# Altium schematic sheet Mobo.SchDoc: Tray 2 Motherboard
size A2; DrawnBy: M. Wenke; Engineer: M. Wenke; DocumentNumber: CRSC0007; SheetNumber: 1; SheetTotal: 1; Version: 1.0
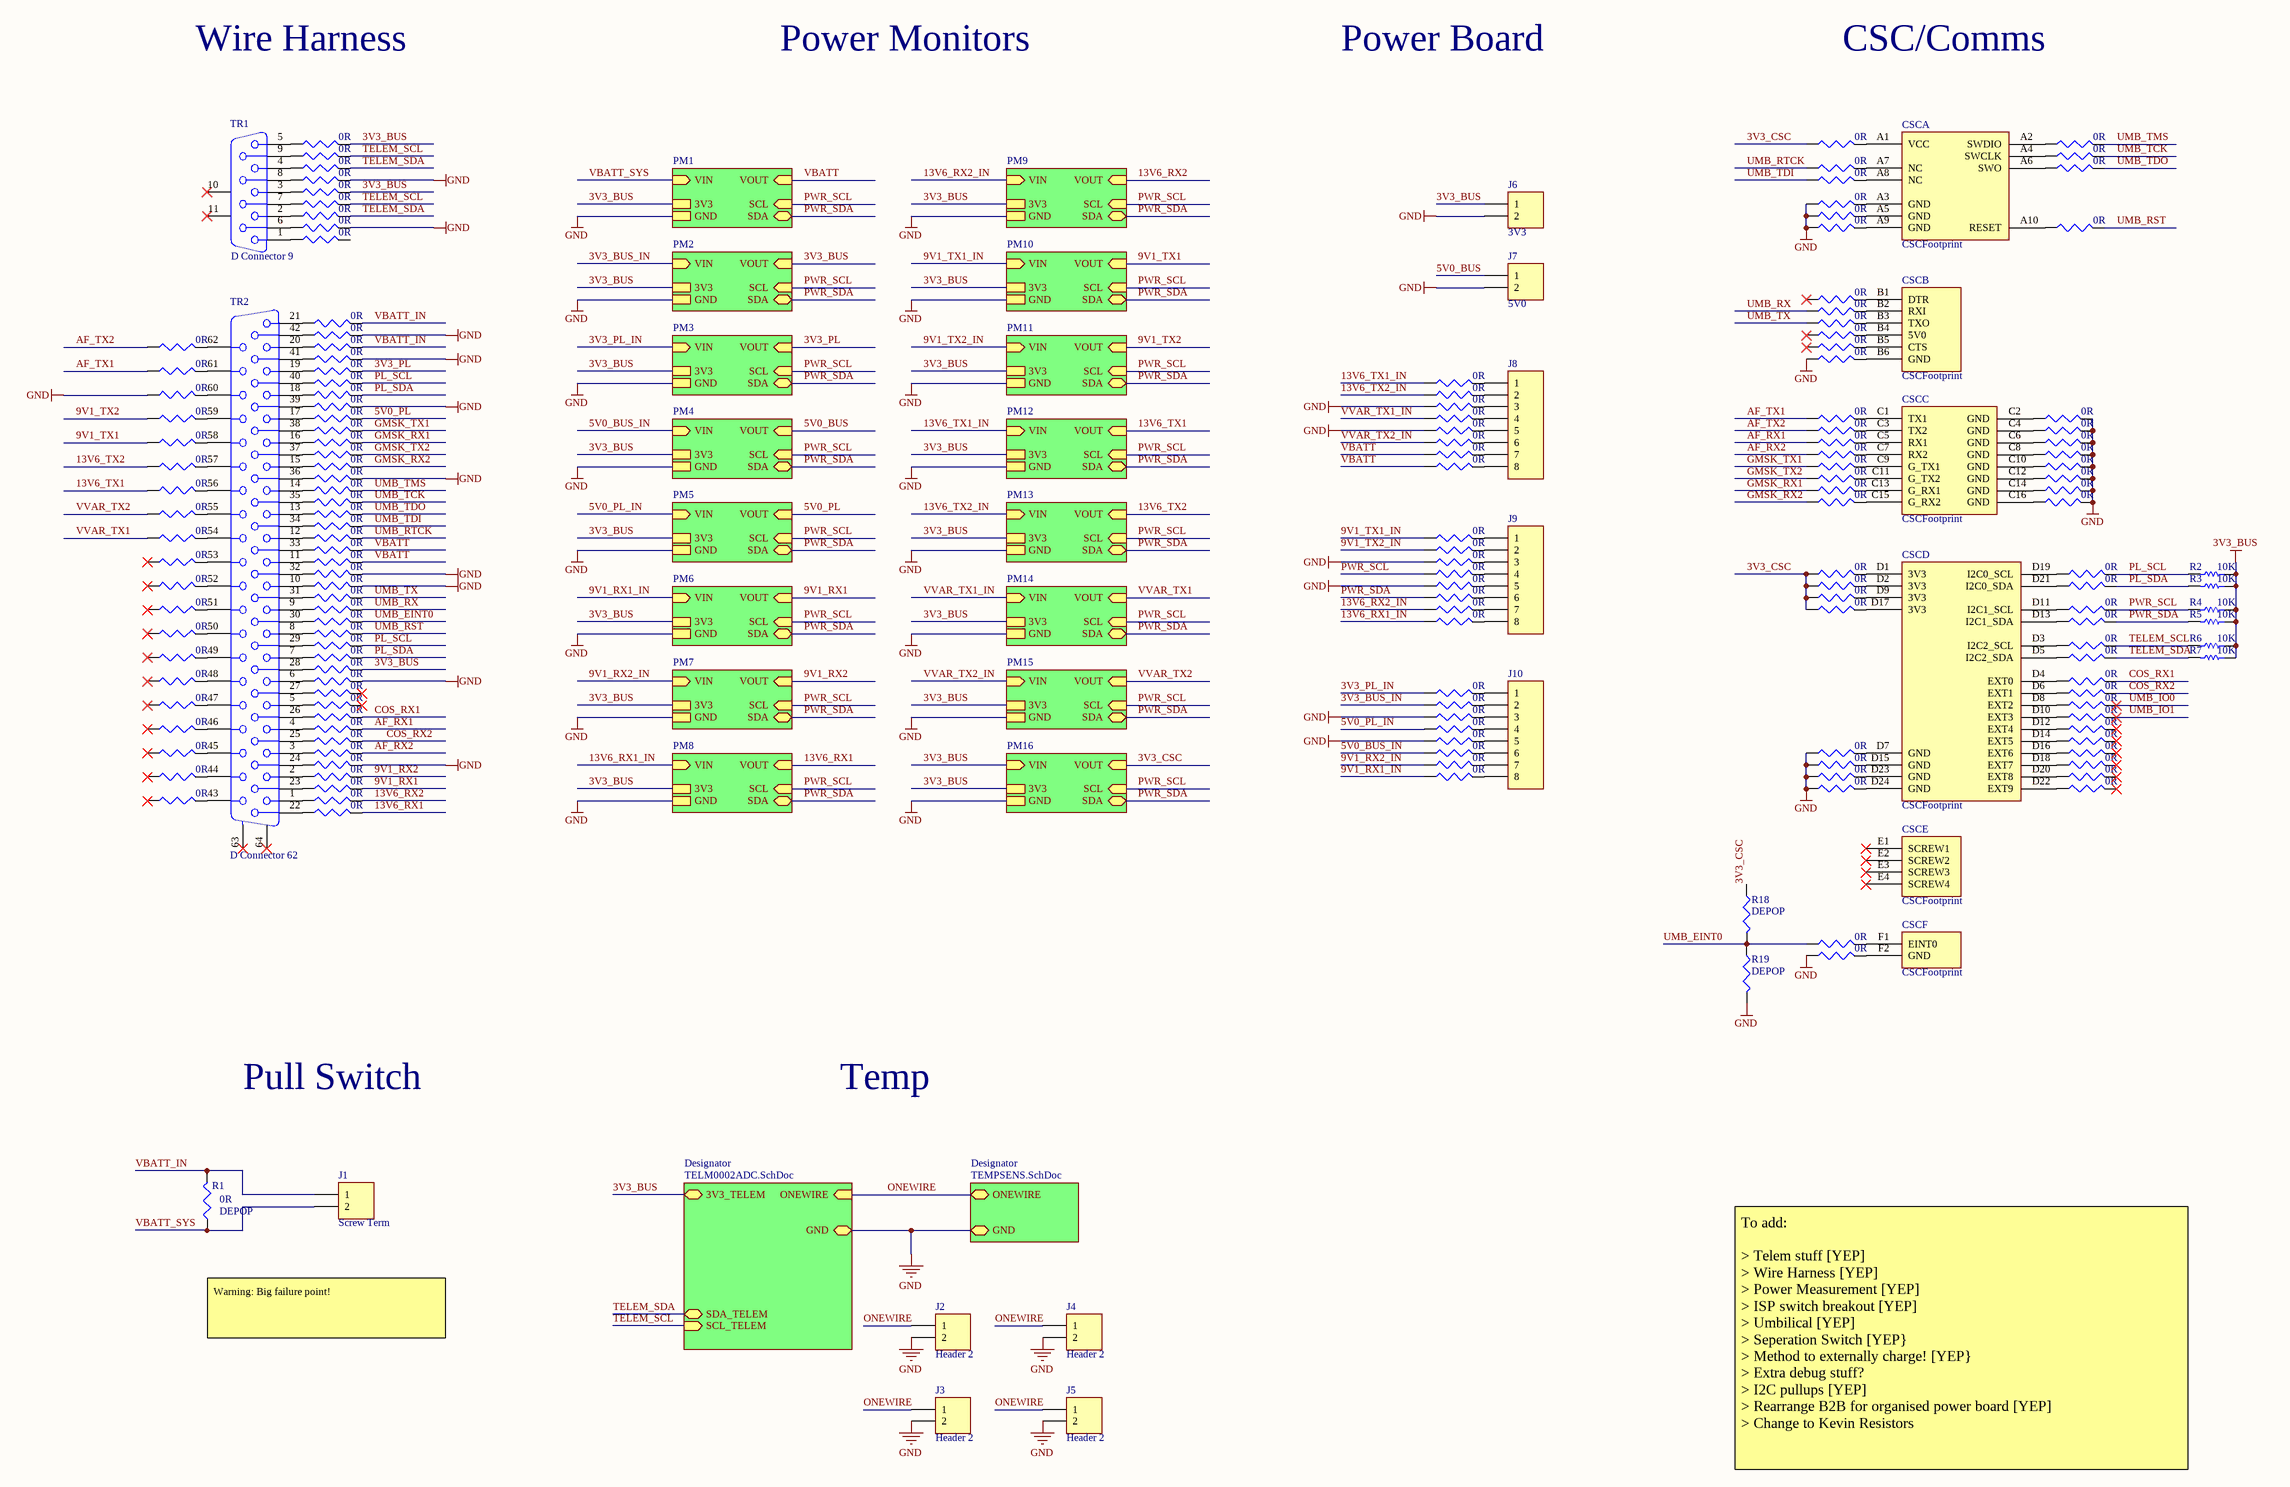
[diagram p0: Mobo.SchDoc]

## Parts
CSC  CSCFootprint  [CSCFootprint]  (parts A,B,C,D,E,F of 6)
J1  Screw Term  [100mil ScrewTerm]
J2  Header 2  [HDR1X2]
J3  Header 2  [HDR1X2]
J4  Header 2  [HDR1X2]
J5  Header 2  [HDR1X2]
J6  3V3  [HDR1X2]
J7  5V0  [HDR1X2]
J8  J?  [MOLEX 444280802]  (value not drawn)
J9  J?  [MOLEX 444280802]  (value not drawn)
J10  J?  [MOLEX 444280802]  (value not drawn)
R1  DEPOP  value 0R  [R0402M]
R2  value 10K  [R0402M]
R3  value 10K  [R0402M]
R4  value 10K  [R0402M]
R5  value 10K  [R0402M]
R6  value 10K  [R0402M]
R7  value 10K  [R0402M]
R18  DEPOP  [R0402M]
R19  DEPOP  [R0402M]
TR1  D Connector 9  [HD-20 9 POS]
TR2  D Connector 62  [HD-22 62 POS]
Z1  value 0R  [Short]
Z2  value 0R  [Short]
Z3  value 0R  [Short]
Z4  value 0R  [Short]
Z5  value 0R  [Short]
Z6  value 0R  [Short]
Z7  value 0R  [Short]
Z8  value 0R  [Short]
Z9  value 0R  [Short]
Z10  value 0R  [Short]
Z11  value 0R  [Short]
Z12  value 0R  [Short]
Z13  value 0R  [Short]
Z14  value 0R  [Short]
Z15  value 0R  [Short]
Z16  value 0R  [Short]
Z17  value 0R  [Short]
Z18  value 0R  [Short]
Z19  value 0R  [Short]
Z20  value 0R  [Short]
Z21  value 0R  [Short]
Z22  value 0R  [Short]
Z23  value 0R  [Short]
Z24  value 0R  [Short]
Z25  value 0R  [Short]
Z26  value 0R  [Short]
Z27  value 0R  [Short]
Z28  value 0R  [Short]
Z29  value 0R  [Short]
Z30  value 0R  [Short]
Z31  value 0R  [Short]
Z32  value 0R  [Short]
Z33  value 0R  [Short]
Z34  value 0R  [Short]
Z35  value 0R  [Short]
Z36  value 0R  [Short]
Z37  value 0R  [Short]
Z38  value 0R  [Short]
Z39  value 0R  [Short]
Z40  value 0R  [Short]
Z41  value 0R  [Short]
Z42  value 0R  [Short]
Z43  value 0R  [Short]
Z44  value 0R  [Short]
Z45  value 0R  [Short]
Z46  value 0R  [Short]
Z47  value 0R  [Short]
Z48  value 0R  [Short]
Z49  value 0R  [Short]
Z50  value 0R  [Short]
Z51  value 0R  [Short]
Z52  value 0R  [Short]
Z53  value 0R  [Short]
Z54  value 0R  [Short]
Z55  value 0R  [Short]
Z56  value 0R  [Short]
Z57  value 0R  [Short]
Z58  value 0R  [Short]
Z59  value 0R  [Short]
Z60  value 0R  [Short]
Z61  value 0R  [Short]
Z62  value 0R  [Short]
Z63  value 0R  [Short]
Z64  value 0R  [Short]
Z65  value 0R  [Short]
Z66  value 0R  [Short]
Z67  value 0R  [Short]
Z68  value 0R  [Short]
Z69  value 0R  [Short]
Z70  value 0R  [Short]
Z71  value 0R  [Short]
Z72  value 0R  [Short]
Z73  value 0R  [Short]
Z74  value 0R  [Short]
Z75  value 0R  [Short]
Z76  value 0R  [Short]
Z77  value 0R  [Short]
Z78  value 0R  [Short]
Z79  value 0R  [Short]
Z80  value 0R  [Short]
Z81  value 0R  [Short]
Z82  value 0R  [Short]
Z83  value 0R  [Short]
Z84  value 0R  [Short]
Z85  value 0R  [Short]
Z86  value 0R  [Short]
Z87  value 0R  [Short]
Z88  value 0R  [Short]
Z89  value 0R  [Short]
Z90  value 0R  [Short]
Z91  value 0R  [Short]
Z92  value 0R  [Short]
Z93  value 0R  [Short]
Z94  value 0R  [Short]
Z95  value 0R  [Short]
Z96  value 0R  [Short]
Z97  value 0R  [Short]
Z98  value 0R  [Short]
Z99  value 0R  [Short]
Z100  value 0R  [Short]
Z101  value 0R  [Short]
Z102  value 0R  [Short]
Z103  value 0R  [Short]
Z104  value 0R  [Short]
Z105  value 0R  [Short]
Z106  value 0R  [Short]
Z107  value 0R  [Short]
Z108  value 0R  [Short]
Z109  value 0R  [Short]
Z110  value 0R  [Short]
Z111  value 0R  [Short]
Z112  value 0R  [Short]
Z113  value 0R  [Short]
Z114  value 0R  [Short]
Z115  value 0R  [Short]
Z116  value 0R  [Short]
Z117  value 0R  [Short]
Z118  value 0R  [Short]
Z119  value 0R  [Short]
Z120  value 0R  [Short]
Z121  value 0R  [Short]
Z122  value 0R  [Short]
Z123  value 0R  [Short]
Z124  value 0R  [Short]
Z125  value 0R  [Short]
Z126  value 0R  [Short]
Z127  value 0R  [Short]
Z128  value 0R  [Short]
Z129  value 0R  [Short]
Z130  value 0R  [Short]
Z131  value 0R  [Short]
Z132  value 0R  [Short]
Z133  value 0R  [Short]
Z134  value 0R  [Short]
Z135  value 0R  [Short]
Z136  value 0R  [Short]
Z137  value 0R  [Short]
Z138  value 0R  [Short]
Z139  value 0R  [Short]
Z140  value 0R  [Short]
Z141  value 0R  [Short]
Z142  value 0R  [Short]
Z143  value 0R  [Short]
Z144  value 0R  [Short]
Z145  value 0R  [Short]
Z146  value 0R  [Short]
Z147  value 0R  [Short]
Z148  value 0R  [Short]
Z149  value 0R  [Short]
Z150  value 0R  [Short]
Z151  value 0R  [Short]
Z152  value 0R  [Short]
Z153  value 0R  [Short]

## Sub-sheets
Designator = TELM0002ADC.SchDoc: SDA_TELEM (bidir), SCL_TELEM (in), ONEWIRE (in), 3V3_TELEM, GND
Designator = TEMPSENS.SchDoc: GND, ONEWIRE (bidir)
PM1 = PowerMonitor.SchDoc: SDA (bidir), SCL (in), VIN (in), VOUT (in), 3V3, GND
PM2 = PowerMonitor.SchDoc: SDA (bidir), SCL (in), VIN (in), VOUT (in), 3V3, GND
PM3 = PowerMonitor.SchDoc: SDA (bidir), SCL (in), VIN (in), VOUT (in), 3V3, GND
PM4 = PowerMonitor.SchDoc: SDA (bidir), SCL (in), VIN (in), VOUT (in), 3V3, GND
PM5 = PowerMonitor.SchDoc: SDA (bidir), SCL (in), VIN (in), VOUT (in), 3V3, GND
PM6 = PowerMonitor.SchDoc: SDA (bidir), SCL (in), VIN (in), VOUT (in), 3V3, GND
PM7 = PowerMonitor.SchDoc: SDA (bidir), SCL (in), VIN (in), VOUT (in), 3V3, GND
PM8 = PowerMonitor.SchDoc: SDA (bidir), SCL (in), VIN (in), VOUT (in), 3V3, GND
PM9 = PowerMonitor.SchDoc: SDA (bidir), SCL (in), VIN (in), VOUT (in), 3V3, GND
PM10 = PowerMonitor.SchDoc: SDA (bidir), SCL (in), VIN (in), VOUT (in), 3V3, GND
PM11 = PowerMonitor.SchDoc: SDA (bidir), SCL (in), VIN (in), VOUT (in), 3V3, GND
PM12 = PowerMonitor.SchDoc: SDA (bidir), SCL (in), VIN (in), VOUT (in), 3V3, GND
PM13 = PowerMonitor.SchDoc: SDA (bidir), SCL (in), VIN (in), VOUT (in), 3V3, GND
PM14 = PowerMonitor.SchDoc: SDA (bidir), SCL (in), VIN (in), VOUT (in), 3V3, GND
PM15 = PowerMonitor.SchDoc: SDA (bidir), SCL (in), VIN (in), VOUT (in), 3V3, GND
PM16 = PowerMonitor.SchDoc: SDA (bidir), SCL (in), VIN (in), VOUT (in), 3V3, GND

## Nets
3V3_BUS: J6.1 R2.1 R3.1 R4.1 R5.1 R6.1 R7.1 Z21.2 Z25.2 Z59.2 ; sheet PM1/3V3, sheet Designator/3V3_TELEM, sheet PM2/VOUT, sheet PM2/3V3, sheet PM3/3V3, sheet PM4/3V3, sheet PM5/3V3, sheet PM6/3V3, sheet PM7/3V3, sheet PM8/3V3, sheet PM9/3V3, sheet PM10/3V3, sheet PM11/3V3, sheet PM12/3V3, sheet PM13/3V3, sheet PM14/3V3, sheet PM15/3V3, sheet PM16/VIN, sheet PM16/3V3
GND: J2.2 J3.2 J4.2 J5.2 J6.2 J7.2 R19.2 Z3.1 Z24.2 Z28.2 Z31.2 Z33.2 Z37.2 Z43.2 Z51.2 Z52.2 Z60.2 Z67.2 Z74.1 Z76.1 Z82.1 Z84.1 Z90.1 Z92.1 Z99.1 Z100.1 Z101.1 Z107.1 Z120.1 Z121.1 Z122.1 Z123.1 Z125.1 Z126.2 Z127.2 Z128.2 Z129.2 Z130.2 Z131.2 Z132.2 Z133.2 ; sheet PM1/GND, sheet Designator/GND, sheet Designator/GND, sheet PM2/GND, sheet PM3/GND, sheet PM4/GND, sheet PM5/GND, sheet PM6/GND, sheet PM7/GND, sheet PM8/GND, sheet PM9/GND, sheet PM10/GND, sheet PM11/GND, sheet PM12/GND, sheet PM13/GND, sheet PM14/GND, sheet PM15/GND, sheet PM16/GND
3V3_BUS_IN: Z89.1 ; sheet PM2/VIN
3V3_CSC: R18.1 Z96.1 Z116.1 Z117.1 Z118.1 Z119.1 ; sheet PM16/VOUT
3V3_PL: Z34.2 ; sheet PM3/VOUT
3V3_PL_IN: Z88.1 ; sheet PM3/VIN
5V0_BUS: J7.1 ; sheet PM4/VOUT
5V0_BUS_IN: Z93.1 ; sheet PM4/VIN
5V0_PL: Z38.2 ; sheet PM5/VOUT
5V0_PL_IN: Z91.1 ; sheet PM5/VIN
9V1_RX1: Z69.2 ; sheet PM6/VOUT
9V1_RX1_IN: Z95.1 ; sheet PM6/VIN
9V1_RX2: Z68.2 ; sheet PM7/VOUT
9V1_RX2_IN: Z94.1 ; sheet PM7/VIN
9V1_TX1: Z5.1 ; sheet PM10/VOUT
9V1_TX1_IN: Z80.1 ; sheet PM10/VIN
9V1_TX2: Z4.1 ; sheet PM11/VOUT
9V1_TX2_IN: Z81.1 ; sheet PM11/VIN
13V6_RX1: Z71.2 ; sheet PM8/VOUT
13V6_RX1_IN: Z87.1 ; sheet PM8/VIN
13V6_RX2: Z70.2 ; sheet PM9/VOUT
13V6_RX2_IN: Z86.1 ; sheet PM9/VIN
13V6_TX1: Z7.1 ; sheet PM12/VOUT
13V6_TX1_IN: Z72.1 ; sheet PM12/VIN
13V6_TX2: Z6.1 ; sheet PM13/VOUT
13V6_TX2_IN: Z73.1 ; sheet PM13/VIN
AF_RX1: Z64.2 Z110.1
AF_RX2: Z66.2 Z111.1
AF_TX1: Z2.1 Z108.1
AF_TX2: Z1.1 Z109.1
COS_RX1: Z63.2 Z144.2
COS_RX2: Z65.2 Z145.2
GMSK_RX1: Z40.2 Z114.1
GMSK_RX2: Z42.2 Z115.1
GMSK_TX1: Z39.2 Z112.1
GMSK_TX2: Z41.2 Z113.1
ONEWIRE: J2.1 J3.1 J4.1 J5.1 ; sheet Designator/ONEWIRE, sheet Designator/ONEWIRE
PL_SCL: R2.2 Z35.2 Z57.2 Z138.2
PL_SDA: R3.2 Z36.2 Z58.2 Z139.2
PWR_SCL: R4.2 Z83.1 Z140.2 ; sheet PM1/SCL, sheet PM2/SCL, sheet PM3/SCL, sheet PM4/SCL, sheet PM5/SCL, sheet PM6/SCL, sheet PM7/SCL, sheet PM8/SCL, sheet PM9/SCL, sheet PM10/SCL, sheet PM11/SCL, sheet PM12/SCL, sheet PM13/SCL, sheet PM14/SCL, sheet PM15/SCL, sheet PM16/SCL
PWR_SDA: R5.2 Z85.1 Z141.2 ; sheet PM1/SDA, sheet PM2/SDA, sheet PM3/SDA, sheet PM4/SDA, sheet PM5/SDA, sheet PM6/SDA, sheet PM7/SDA, sheet PM8/SDA, sheet PM9/SDA, sheet PM10/SDA, sheet PM11/SDA, sheet PM12/SDA, sheet PM13/SDA, sheet PM14/SDA, sheet PM15/SDA, sheet PM16/SDA
TELEM_SCL: R6.2 Z22.2 Z26.2 Z142.2 ; sheet Designator/SCL_TELEM
TELEM_SDA: R7.2 Z23.2 Z27.2 Z143.2 ; sheet Designator/SDA_TELEM
UMB_EINT0: R18.2 R19.1 Z55.2 Z124.1
UMB_IO0: Z146.2
UMB_IO1: Z147.2
UMB_RST: Z56.2 Z137.2
UMB_RTCK: Z48.2 Z97.1
UMB_RX: Z54.2 Z103.1
UMB_TCK: Z45.2 Z135.2
UMB_TDI: Z47.2 Z98.1
UMB_TDO: Z46.2 Z136.2
UMB_TMS: Z44.2 Z134.2
UMB_TX: Z53.2 Z104.1
VBATT: Z49.2 Z50.2 Z78.1 Z79.1 ; sheet PM1/VOUT
VBATT_IN: J1.1 R1.2 Z30.2 Z32.2
VBATT_SYS: J1.2 R1.1 ; sheet PM1/VIN
VVAR_TX1: Z9.1 ; sheet PM14/VOUT
VVAR_TX1_IN: Z75.1 ; sheet PM14/VIN
VVAR_TX2: Z8.1 ; sheet PM15/VOUT
VVAR_TX2_IN: Z77.1 ; sheet PM15/VIN
NetCSC_A1: CSC.A1(VCC) Z96.2
NetCSC_A2: CSC.A2(SWDIO) Z134.1
NetCSC_A3: CSC.A3(GND) Z99.2
NetCSC_A4: CSC.A4(SWCLK) Z135.1
NetCSC_A5: CSC.A5(GND) Z100.2
NetCSC_A6: CSC.A6(SWO) Z136.1
NetCSC_A7: CSC.A7(NC) Z97.2
NetCSC_A8: CSC.A8(NC) Z98.2
NetCSC_A9: CSC.A9(GND) Z101.2
NetCSC_A10: CSC.A10(RESET) Z137.1
NetCSC_B1: CSC.B1(DTR) Z102.2
NetCSC_B2: CSC.B2(RXI) Z103.2
NetCSC_B3: CSC.B3(TXO) Z104.2
NetCSC_B4: CSC.B4(5V0) Z105.2
NetCSC_B5: CSC.B5(CTS) Z106.2
NetCSC_B6: CSC.B6(GND) Z107.2
NetCSC_C1: CSC.C1(TX1) Z108.2
NetCSC_C2: CSC.C2(GND) Z126.1
NetCSC_C3: CSC.C3(TX2) Z109.2
NetCSC_C4: CSC.C4(GND) Z127.1
NetCSC_C5: CSC.C5(RX1) Z110.2
NetCSC_C6: CSC.C6(GND) Z128.1
NetCSC_C7: CSC.C7(RX2) Z111.2
NetCSC_C8: CSC.C8(GND) Z129.1
NetCSC_C9: CSC.C9(G_TX1) Z112.2
NetCSC_C10: CSC.C10(GND) Z130.1
NetCSC_C11: CSC.C11(G_TX2) Z113.2
NetCSC_C12: CSC.C12(GND) Z131.1
NetCSC_C13: CSC.C13(G_RX1) Z114.2
NetCSC_C14: CSC.C14(GND) Z132.1
NetCSC_C15: CSC.C15(G_RX2) Z115.2
NetCSC_C16: CSC.C16(GND) Z133.1
NetCSC_D1: CSC.D1(3V3) Z116.2
NetCSC_D2: CSC.D2(3V3) Z117.2
NetCSC_D3: CSC.D3(I2C2_SCL) Z142.1
NetCSC_D4: CSC.D4(EXT0) Z144.1
NetCSC_D5: CSC.D5(I2C2_SDA) Z143.1
NetCSC_D6: CSC.D6(EXT1) Z145.1
NetCSC_D7: CSC.D7(GND) Z120.2
NetCSC_D8: CSC.D8(EXT2) Z146.1
NetCSC_D9: CSC.D9(3V3) Z118.2
NetCSC_D10: CSC.D10(EXT3) Z147.1
NetCSC_D11: CSC.D11(I2C1_SCL) Z140.1
NetCSC_D12: CSC.D12(EXT4) Z148.1
NetCSC_D13: CSC.D13(I2C1_SDA) Z141.1
NetCSC_D14: CSC.D14(EXT5) Z149.1
NetCSC_D15: CSC.D15(GND) Z121.2
NetCSC_D16: CSC.D16(EXT6) Z150.1
NetCSC_D17: CSC.D17(3V3) Z119.2
NetCSC_D18: CSC.D18(EXT7) Z151.1
NetCSC_D19: CSC.D19(I2C0_SCL) Z138.1
NetCSC_D20: CSC.D20(EXT8) Z152.1
NetCSC_D21: CSC.D21(I2C0_SDA) Z139.1
NetCSC_D22: CSC.D22(EXT9) Z153.1
NetCSC_D23: CSC.D23(GND) Z122.2
NetCSC_D24: CSC.D24(GND) Z123.2
NetCSC_F1: CSC.F1(EINT0) Z124.2
NetCSC_F2: CSC.F2(GND) Z125.2
NetJ8_1: J8.1 Z72.2
NetJ8_2: J8.2 Z73.2
NetJ8_3: J8.3 Z74.2
NetJ8_4: J8.4 Z75.2
NetJ8_5: J8.5 Z76.2
NetJ8_6: J8.6 Z77.2
NetJ8_7: J8.7 Z78.2
NetJ8_8: J8.8 Z79.2
NetJ9_1: J9.1 Z80.2
NetJ9_2: J9.2 Z81.2
NetJ9_3: J9.3 Z82.2
NetJ9_4: J9.4 Z83.2
NetJ9_5: J9.5 Z84.2
NetJ9_6: J9.6 Z85.2
NetJ9_7: J9.7 Z86.2
NetJ9_8: J9.8 Z87.2
NetJ10_1: J10.1 Z88.2
NetJ10_2: J10.2 Z89.2
NetJ10_3: J10.3 Z90.2
NetJ10_4: J10.4 Z91.2
NetJ10_5: J10.5 Z92.2
NetJ10_6: J10.6 Z93.2
NetJ10_7: J10.7 Z94.2
NetJ10_8: J10.8 Z95.2
NetTR1_1: TR1.1 Z29.1
NetTR1_2: TR1.2 Z27.1
NetTR1_3: TR1.3 Z25.1
NetTR1_4: TR1.4 Z23.1
NetTR1_5: TR1.5 Z21.1
NetTR1_6: TR1.6 Z28.1
NetTR1_7: TR1.7 Z26.1
NetTR1_8: TR1.8 Z24.1
NetTR1_9: TR1.9 Z22.1
NetTR2_1: TR2.1 Z70.1
NetTR2_2: TR2.2 Z68.1
NetTR2_3: TR2.3 Z66.1
NetTR2_4: TR2.4 Z64.1
NetTR2_5: TR2.5 Z62.1
NetTR2_6: TR2.6 Z60.1
NetTR2_7: TR2.7 Z58.1
NetTR2_8: TR2.8 Z56.1
NetTR2_9: TR2.9 Z54.1
NetTR2_10: TR2.10 Z52.1
NetTR2_11: TR2.11 Z50.1
NetTR2_12: TR2.12 Z48.1
NetTR2_13: TR2.13 Z46.1
NetTR2_14: TR2.14 Z44.1
NetTR2_15: TR2.15 Z42.1
NetTR2_16: TR2.16 Z40.1
NetTR2_17: TR2.17 Z38.1
NetTR2_18: TR2.18 Z36.1
NetTR2_19: TR2.19 Z34.1
NetTR2_20: TR2.20 Z32.1
NetTR2_21: TR2.21 Z30.1
NetTR2_22: TR2.22 Z71.1
NetTR2_23: TR2.23 Z69.1
NetTR2_24: TR2.24 Z67.1
NetTR2_25: TR2.25 Z65.1
NetTR2_26: TR2.26 Z63.1
NetTR2_27: TR2.27 Z61.1
NetTR2_28: TR2.28 Z59.1
NetTR2_29: TR2.29 Z57.1
NetTR2_30: TR2.30 Z55.1
NetTR2_31: TR2.31 Z53.1
NetTR2_32: TR2.32 Z51.1
NetTR2_33: TR2.33 Z49.1
NetTR2_34: TR2.34 Z47.1
NetTR2_35: TR2.35 Z45.1
NetTR2_36: TR2.36 Z43.1
NetTR2_37: TR2.37 Z41.1
NetTR2_38: TR2.38 Z39.1
NetTR2_39: TR2.39 Z37.1
NetTR2_40: TR2.40 Z35.1
NetTR2_41: TR2.41 Z33.1
NetTR2_42: TR2.42 Z31.1
NetTR2_43: TR2.43 Z20.2
NetTR2_44: TR2.44 Z19.2
NetTR2_45: TR2.45 Z18.2
NetTR2_46: TR2.46 Z17.2
NetTR2_47: TR2.47 Z16.2
NetTR2_48: TR2.48 Z15.2
NetTR2_49: TR2.49 Z14.2
NetTR2_50: TR2.50 Z13.2
NetTR2_51: TR2.51 Z12.2
NetTR2_52: TR2.52 Z11.2
NetTR2_53: TR2.53 Z10.2
NetTR2_54: TR2.54 Z9.2
NetTR2_55: TR2.55 Z8.2
NetTR2_56: TR2.56 Z7.2
NetTR2_57: TR2.57 Z6.2
NetTR2_58: TR2.58 Z5.2
NetTR2_59: TR2.59 Z4.2
NetTR2_60: TR2.60 Z3.2
NetTR2_61: TR2.61 Z2.2
NetTR2_62: TR2.62 Z1.2

Not connected (* = marked no-connect by the designer): CSC E1(SCREW1)* E2(SCREW2)* E3(SCREW3)* E4(SCREW4)*; TR1 10(MH1)* 11(MH2)*; TR2 63(MH1)* 64(MH2)*; Z10 1*; Z11 1*; Z12 1*; Z13 1*; Z14 1*; Z15 1*; Z16 1*; Z17 1*; Z18 1*; Z19 1*; Z20 1*; Z29 2; Z61 2*; Z62 2*; Z102 1*; Z105 1*; Z106 1*; Z148 2*; Z149 2*; Z150 2*; Z151 2*; Z152 2*; Z153 2*

## Notes on the sheet
- Wire Harness
- Power Monitors
- Power Board
- CSC/Comms
- Pull Switch
- Temp
- Warning: Big failure point!
- To add:
  > Telem stuff [YEP]
  > Wire Harness [YEP]
  > Power Measurement [YEP]
  > ISP switch breakout [YEP]
  > Umbilical [YEP]
  > Seperation Switch [YEP}
  > Method to externally charge! [YEP}
  > Extra debug stuff?
  > I2C pullups [YEP]
  > Rearrange B2B for organised power board [YEP]
  > Change to Kevin Resistors
- Title
- Description:
- Size:
- Author:
- Date:
- File:
- A2
- Time:
- Version
- Sheet:
- Drawing No.:
- of

## Library data of the parts
J1-J7 = Header 2: Header, 2-Pin; LatestRevisionDate: 17-Jul-2002; LatestRevisionNote: Re-released for DXP Platform.; Publisher: Altium Limited
J8-J10 = MOLEX 444280802: B2B RA Header
R1 Z1-Z153 = Res3: Resistor; Published: 8-Jun-2000; LatestRevisionDate: 29-May-2009; LatestRevisionNote: IPC-7351 Footprint Added.; PackageReference: J1-0603; Publisher: Altium Limited; PackageDescription: Chip Resistor
R2-R7 = Res1: Resistor; Published: 8-Jun-2000; LatestRevisionDate: 17-Jul-2002; LatestRevisionNote: Re-released for DXP Platform.; PackageReference: AXIAL-0.3; Publisher: Altium Limited; PackageDescription: Axial Device, Thru-Hole; 2 Leads; 0.3 in Pin Spacing
R18 R19 = Res3: Resistor; Value: 0R; Published: 8-Jun-2000; LatestRevisionDate: 29-May-2009; LatestRevisionNote: IPC-7351 Footprint Added.; PackageReference: J1-0603; Publisher: Altium Limited; PackageDescription: Chip Resistor
TR1 = D Connector 9: Receptacle Assembly, 9 Position, Right Angle; PackageDocument: O; Positions: 9; Published: 15-Jun-2001; LatestRevisionDate: 17-Jul-2002; LatestRevisionNote: Re-released for DXP Platform.; DatasheetDocument: 1-Sep-1999; PackageReference: 788750; Publisher: Altium Limited; Orientation: Right Angle; Gender: Receptacle
TR2 = Connector 62